# Altium schematic sheet 7_seg_display.SchDoc
size A4; SheetNumber: 2; SheetTotal: 2
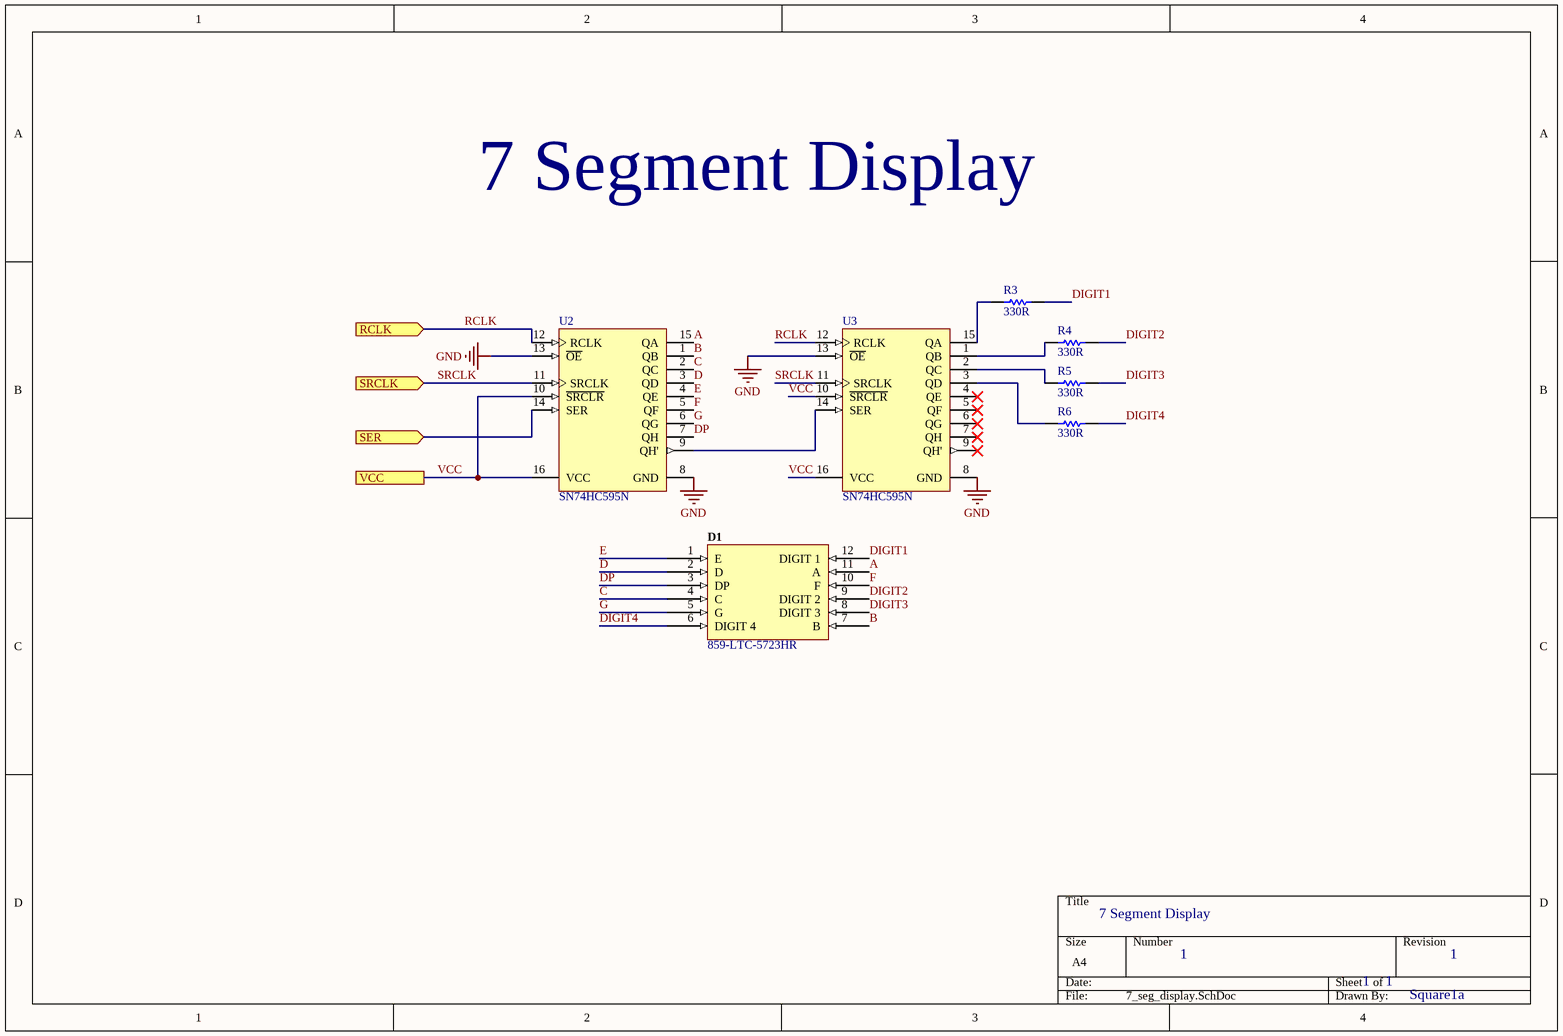
[diagram p0: 7_seg_display.SchDoc]

## Parts
D1  Supplier Part Number 1: 859-LTC-5723HR  [7 SEG DISPLAY (DIP12)]  (hidden comment: 4 digit display)
R3  330R  [RESA60-630X240]
R4  330R  [RESA60-630X240]
R5  330R  [RESA60-630X240]
R6  330R  [RESA60-630X240]
U2  SN74HC595N  [N0016A]
U3  SN74HC595N  [N0016A]

## Ports
RCLK (in), SER (in), SRCLK (in), VCC

## Nets
GND: U2.8(GND) U2.13(~{OE}) U3.8(GND) U3.13(~{OE})
A: D1.11(A) U2.15(QA)
B: D1.7(B) U2.1(QB)
C: D1.4(C) U2.2(QC)
D: D1.2(D) U2.3(QD)
DIGIT1: D1.12(DIGIT_1) R3.1
DIGIT2: D1.9(DIGIT_2) R4.1
DIGIT3: D1.8(DIGIT_3) R5.1
DIGIT4: D1.6(DIGIT_4) R6.1
DP: D1.3(DP) U2.7(QH)
E: D1.1(E) U2.4(QE)
F: D1.10(F) U2.5(QF)
G: D1.5(G) U2.6(QG)
RCLK: U2.12(RCLK) U3.12(RCLK) ; port RCLK
SER: U2.14(SER) ; port SER
SRCLK: U2.11(SRCLK) U3.11(SRCLK) ; port SRCLK
VCC: U2.10(~{SRCLR}) U2.16(VCC) U3.10(~{SRCLR}) U3.16(VCC) ; port VCC
NetR3_2: R3.2 U3.15(QA)
NetR4_2: R4.2 U3.1(QB)
NetR5_2: R5.2 U3.2(QC)
NetR6_2: R6.2 U3.3(QD)
NetU2_9: U2.9(QH') U3.14(SER)

Not connected (* = marked no-connect by the designer): U3 4(QE)* 5(QF)* 6(QG)* 7(QH)* 9(QH')*

## Notes on the sheet
- 7 Segment Display
- 1
- Square1a

## Library data of the parts
D1 = LTC-5723HR: Displays Segmented Panel 4DIGIT 32LED Hi-Eff. Red CC 12-Pin DIP; Manufacturer: Vishay Lite-On; Operating Supply Voltage: 2V; Wavelength: 623nm; Forward Current: 20mA; Element Configuration: Common Cathode; Test Current: 10mA; Power Dissipation: 75mW; Number of Elements: 32; Reverse Voltage: 5V; Viewing Area (height): 14.2mm; Viewing Area Length: 8.1mm; Supplier 1: Mouser; Manufacturer Part Number: LTC-5723HR; RoHS: Yes; Category: LED Displays; Stock 1: 897; Pricing 1: 1=2.97000, 10=2.09000, 50=2.09000, 100=1.71000, 1000=1.32000, 10000=1.25000 (USD); Mount: Through Hole; Case/Package: DIP; Number of Pins: 12; Min Operating Temperature: -35°C; Max Operating Temperature: 85°C; Package Quantity: 10; Illumination Color: Red; Forward Voltage: 2V; Packaging: Rail/Tube; Dominant Wavelength: 623nm; Display Type: Segment; Power Consumption: 75mW; Length: 50.3mm; Depth: 19mm; RoHS Compliant: Yes; ComponentLink1URL: https://datasheet.ciiva.com/6355/s-110-c5723hr-6355372.pdf?src-supplier=Digi-Key; ComponentLink1Description: https://datasheet.ciiva.com/6355/s-110-c5723hr-6355372.pdf?src-supplier=Digi-Key
R3-R6 = CMP-1659-00073-1: Axial Resistor, 100 KOhm, +/- 1%, 0.25 W, -55 to 155 degC, 2-Pin THD, RoHS, Bulk; Voltage Rating: 250 V; Power Rating: 250 mW; Resistance: 475 Ohm; PackageDescription: 2-Pin Axial Lead, Dia 2.4 mm, Body Length 6.3 mm; PackageReference: MFR-25; Length: 0.248 inch; ComponentLink2Description: Datasheet; Packaging: Bulk; DatasheetVersion: Apr-13; Package Quantity: 200; Min Operating Temperature: -55 degC; ComponentLink2URL: http://www.yageo.com/documents/recent/Yageo%20LR_MFR_2013.pdf; RoHSCompliant: true; ComponentLink1URL: http://www.yageo.com/; Tolerance: 1%; Case\Package: Axial; Mount: Through Hole; ComponentLink1Description: Manufacturer URL; Max Operating Temperature: 155 degC
U2 U3 = CMP-0780-00137-3: 8-Bit Shift Registers With 3-State Output Registers, N0016A, TUBE; Manufacturer: Texas Instruments; F @ Nom Voltage(Max)(Mhz): 28; Input Type: CMOS; Bits: 8; VCC(Min)(V): 2; 3-State Output: Yes; ICC @ Nom Voltage(Max)(mA): 0.08; VCC(Max)(V): 6; tpd @ Nom Voltage(Max)(ns): 34; Rating: Military; Technology Family: HC; Output Drive (IOL/IOH)(Max)(mA): 7.8/-7.8; Code_JEDEC: MS-001; Output Type: CMOS; Operating Temperature Range(C): -40 to 85; Voltage(Nom)(V): 6; Generic Part Number: SN74HC595; DatasheetVersion: SCLS041H; PackageReference: N0016A; PackageVersion: http://www.ti.com/lit/ml/mpdi002c/mpdi002c.pdf